# EAGLE design Grove - Button v1.0 (EAGLE 7.2.0)
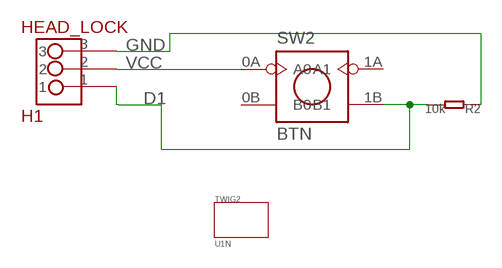
[diagram p0: schematic, sheet 1]

## Parts
H1  HEAD_LOCK  [HEAD_LOCK]
R2  10k  005-R0603  [0603]
SW2  BTN  [BTN_8X8]
TWIG2  U1N  [U1N]

## Nets
D1: H1.1 R2.2 SW2.1B(B1)
GND: H1.3 R2.1
VCC: H1.2 SW2.0A(A0)
Unconnected: SW2.0B(B0) SW2.1A(A1)

## Library data of the parts
H1 = HEAD_LOCK:HEAD_LOCK: 带锁的排座
R2 = Discrete:005-R*
SW2 = Switch_jumpers:BTN
TWIG2 = twig_template1:U1N

## Board
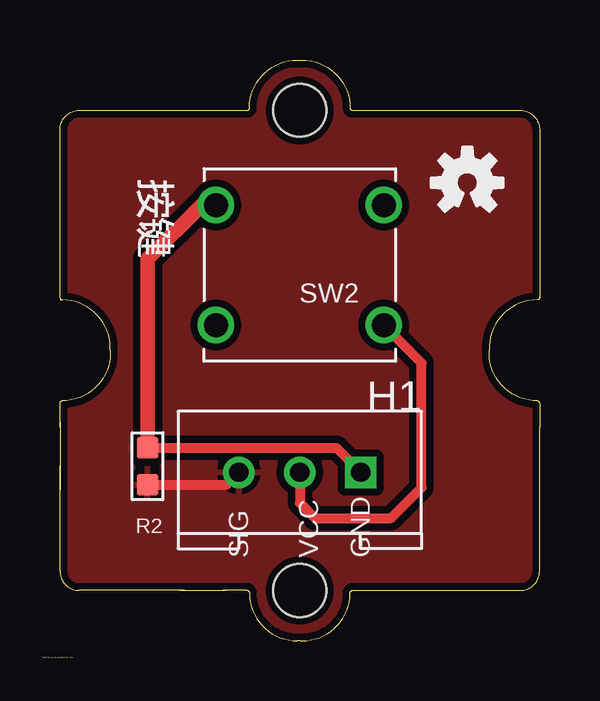
[diagram p1: board, top side]
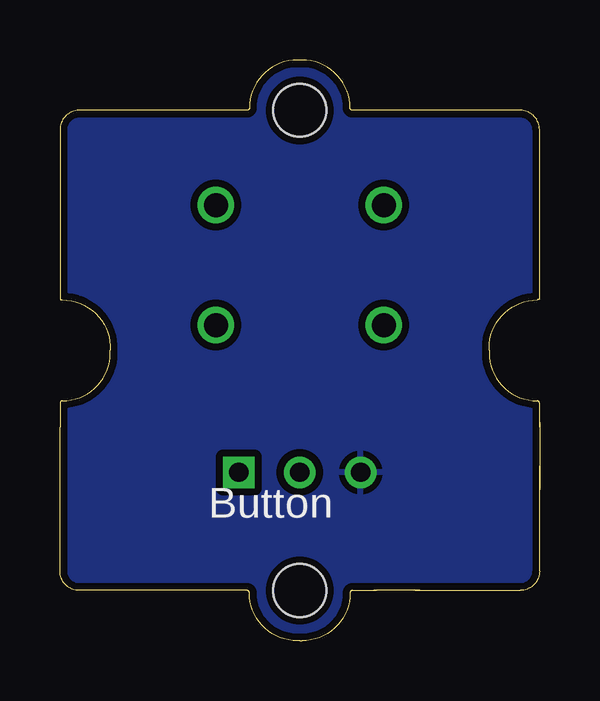
[diagram p2: board, bottom side, seen from below]

Size 20 x 24.2 mm. Coordinates in mm from the lower left corner, seen from the top.
Copper layers (1*16): Top 0.035mm / dielectric 1.5mm / Bottom 0.035mm
Design rules "SeeedStudio_rule_no_angle_090911": minimum track width 6mil, minimum drill 12mil, track to track 6mil, track to pad 6mil, pad to pad 6mil, via to via 6mil, smd to smd 0mil, copper to edge 10mil, drill to drill 10mil, minimum pad ring 10mil, minimum via ring 6mil, stop-mask expansion 2mil, vias tented up to drill 100mil, thermal gap 10mil

### Footprints (pad centres in the part's own frame; a part is rotated, then mirrored left to right if it is on the bottom)
HEAD_LOCK = drill 0.8 square: 1 0,0 | drill 0.8: 2 2.54,0; 3 5.08,0
0603 = smd 0.889 x 0.889: 1 -0.762,0; 2 0.762,0
BTN_8X8 = drill 1: 0A -3.5,2.5; 0B 3.5,2.5; 1A -3.5,-2.5; 1B 3.5,-2.5
U1N = hole 2.2: 0,-10; 0,10

### Placement (x,y rotation side)
H1  12.54,7.02 180 top
R2  3.65,7.27 90 top
SW2  10,15.66 180 top
TWIG2  10,12.1 0 top
U$2  [OSHW-LOGO-S]  16.98,19.09 0 top

### Tracks (layer width: path | path; a pad name or v marks a point on that pad's centre or on a via)
D1
  Top 0.406: R2.2 11.52,8.04 H1.1
  Top 0.61: SW2.1B 5.9,18.16 3.65,15.91 R2.2
GND
  Top 0.406: R2.1 6.95,6.51 H1.3
  pour Top (isolate 0.305): -0.16,24.55 20.16,24.67 20.16,0.04 -0.16,-0.09
  pour Bottom (isolate 0.305): -0.16,24.55 20.16,24.67 20.16,-0.6 -0.16,-0.73
VCC
  Top 0.406: H1.2 10,5.75 10.63,5.12 13.81,5.12 15.08,6.39 15.08,11.58 SW2.0A

### Text on the board
tPlace: SIG | VCC | GND | C:/Users/Xiangzi/Desktop/Ãû³Æ/KEY.bmp
bPlace: Button